# EasyEDA Pro project ProPrj_BrainStimulator-4Channels-Prototype_2025-12-16.epro, schematic Analog Channel
Board Name: Board2; Create Date: 2025-11-10; Page Name: P1; Project Name: BrainStimulator-4Channels-Prototype; Schematic Name: Schematic2; Update Date: 2025-11-10; Company: 嘉立创EDA; Page Size: A4; Version: V1.0
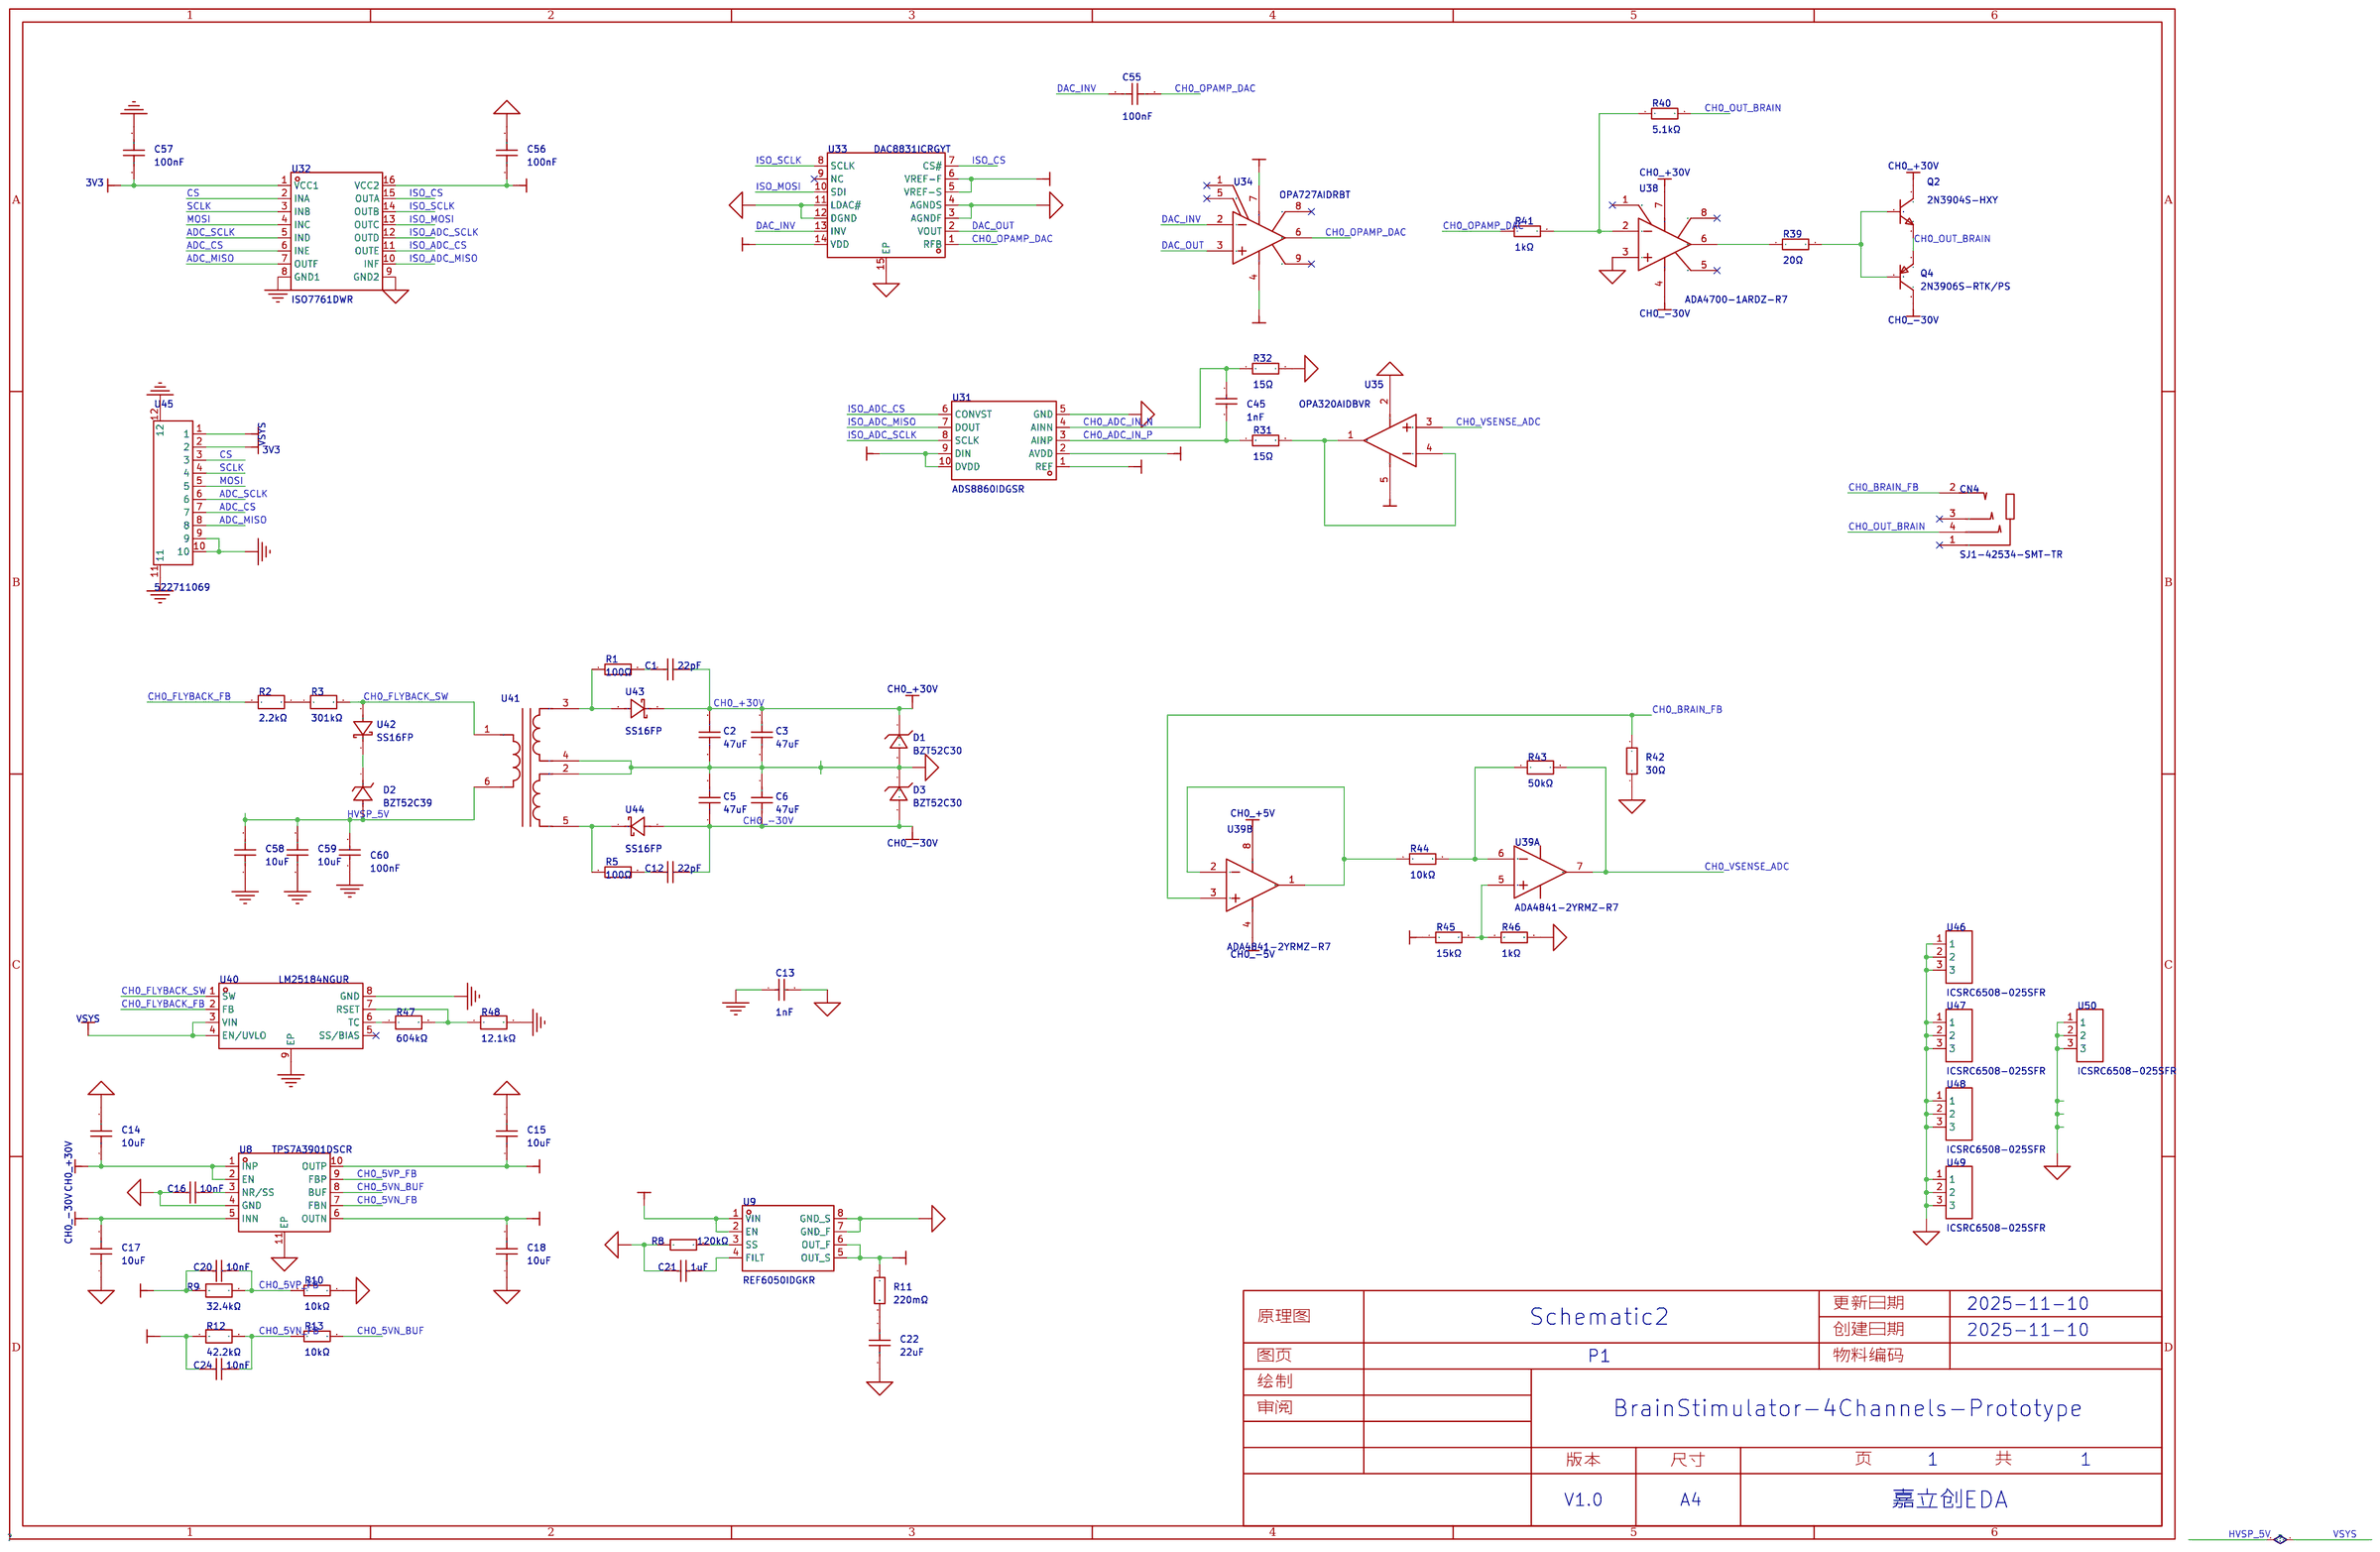
[diagram p1: schematic sheet]

## Parts
C1  22pF  [C0805]
C2  47uF  [CAP-SMD_L6.1-W5.3-L]
C3  47uF  [CAP-SMD_L6.1-W5.3-L]
C5  47uF  [CAP-SMD_L6.1-W5.3-L]
C6  47uF  [CAP-SMD_L6.1-W5.3-L]
C12  22pF  [C0805]
C13  1nF  [C1812]
C14  10uF  [C0805]
C15  10uF  [C0603]
C16  10nF  [C0603]
C17  10uF  [C0805]
C18  10uF  [C0603]
C20  10nF  [C0603]
C21  1uF  [C0603]
C22  22uF  [C0603]
C24  10nF  [C0603]
C45  1nF  [C0603]
C55  100nF  [C0603]
C56  100nF  [C0603]
C57  100nF  [C0603]
C58  10uF  [C0805]
C59  10uF  [C0805]
C60  100nF  [C0805]
CN4  SJ1-42534-SMT-TR  [AUDIO-SMD_SJ1-42534-SMT-TR]
D1  BZT52C30  [SOD-123_L2.8-W1.8-LS3.7-RD]
D2  BZT52C39  [SOD-123_L2.7-W1.6-LS3.7-RD-1]
D3  BZT52C30  [SOD-123_L2.8-W1.8-LS3.7-RD]
Q2  2N3904S-HXY  [SOT-23-3_L3.0-W1.7-P0.95-LS2.9-BR]
Q4  2N3906S-RTK/PS  [SOT-23-3_L2.9-W1.3-P1.90-LS2.4-TR]
R1  100Ω  [R0805]
R2  2.2kΩ  [R0603]
R3  301kΩ  [RES-SMD_L2.0-W1.3]
R5  100Ω  [R0805]
R8  120kΩ  [R0603]
R9  32.4kΩ  [R0603]
R10  10kΩ  [R0603]
R11  220mΩ  [R0603]
R12  42.2kΩ  [R0603]
R13  10kΩ  [R0603]
R31  15Ω  [R0603]
R32  15Ω  [R0603]
R39  20Ω  [R0603]
R40  5.1kΩ  [R0805]
R41  1kΩ  [R0603]
R42  30Ω  [R0805]
R43  50kΩ  [R0603]
R44  10kΩ  [R0603]
R45  15kΩ  [R0603]
R46  1kΩ  [R0603]
R47  604kΩ  [R0603]
R48  12.1kΩ  [R0603]
U8  TPS7A3901DSCR  [WSON-10_L3.0-W3.0-P0.50-BL-EP]
U9  REF6050IDGKR  [VSSOP-8_L3.0-W3.0-P0.65-LS4.9-BL]
U31  ADS8860IDGSR  [VSSOP-10_L3.0-W3.0-P0.50-LS4.9-BL]
U32  ISO7761DWR  [SOIC-16_L10.3-W7.5-P1.27-LS10.3-BL]
U33  DAC8831ICRGYT  [VQFN-14_L3.5-W3.5-P0.50-BL-EP]
U34  OPA727AIDRBT  [SON-8_L3.0-W3.0-P0.65-TL-EP]
U35  OPA320AIDBVR  [SOT-23-5_L3.0-W1.7-P0.95-LS2.8-BR]
U38  ADA4700-1ARDZ-R7  [SOIC-8_L4.9-W3.9-P1.27-LS6.0-BL-EP3.1]
U39  ADA4841-2YRMZ-R7  [MSOP-8_L3.0-W3.0-P0.65-LS4.9-BL]  (sections 1,2)
U40  LM25184NGUR  [WSON-8_L4.0-W4.0-P0.80-BL-EP]
U41  -  [LPH8045]
U42  SS16FP  [SOD-123_L2.8-W1.8-LS3.7-RD]
U43  SS16FP  [SOD-123_L2.8-W1.8-LS3.7-RD]
U44  SS16FP  [SOD-123_L2.8-W1.8-LS3.7-RD]
U45  522711069  [FPC-SMD_10P-P1.00_522711069]
U46  ICSRC6508-025SFR  [SMD-3P_L6.5-W0.8_ICSRC6508-030SFR]
U47  ICSRC6508-025SFR  [SMD-3P_L6.5-W0.8_ICSRC6508-030SFR]
U48  ICSRC6508-025SFR  [SMD-3P_L6.5-W0.8_ICSRC6508-030SFR]
U49  ICSRC6508-025SFR  [SMD-3P_L6.5-W0.8_ICSRC6508-030SFR]
U50  ICSRC6508-025SFR  [SMD-3P_L6.5-W0.8_ICSRC6508-030SFR]

## Library data of the parts
C1 C12 = CL21C220JBANNNC: 容值:22pF;精度:±5%;额定电压:50V;温度系数:C0G;; LCSC Part Name: 22pF ±5% 50V; Supplier Part: C1804; Manufacturer: SAMSUNG(三星); Supplier Footprint: 0805; JLCPCB Part Class: 基础库; Datasheet: https://item.szlcsc.com/datasheet/CL21C220JBANNNC/2156.html; Supplier: LCSC; Tolerance: ±5%; Voltage Rating: 50V; Temperature Coefficient: C0G
C2 C3 C5 C6 = KCM55WR71H476MH13L_C7213084: 容值:47uF;精度:±20%;额定电压:50V;材质(温度系数):X7R;; LCSC Part Name: 47uF ±20% 50V; Supplier Part: C7213084; Manufacturer: muRata(村田); Manufacturer Part: KCM55WR71H476MH13L; Supplier Footprint: SMD,6.1x5.3mm; JLCPCB Part Class: 扩展库; Datasheet: https://atta.szlcsc.com/upload/public/pdf/source/20221122/77B6F680BD34272D8B01742B842790FD.pdf; Supplier: LCSC; Tolerance: ±20%; Voltage Rated: 50V; Temperature Coefficient: X7R
C13 = 1812B102K202NT: 容值:1nF;精度:±10%;额定电压:2kV;温度系数:X7R;; LCSC Part Name: 1nF ±10% 2kV; Supplier Part: C36077; Manufacturer: FH(风华); Supplier Footprint: 1812; JLCPCB Part Class: 扩展库; Datasheet: https://atta.szlcsc.com/upload/public/pdf/source/20200305/C486355_26A10D38EF8C2A5C37091D0039909270.pdf; Supplier: LCSC; Tolerance: ±10%; Voltage Rating: 2kV; Temperature Coefficient: X7R
C14 C17 C58 C59 = GRM21BR61H106KE43L: 容值:10uF;精度:±10%;额定电压:50V;温度系数:X5R;; LCSC Part Name: 10uF ±10% 50V; Supplier Part: C440198; Manufacturer: muRata(村田); Supplier Footprint: 0805; JLCPCB Part Class: Basic Part; Datasheet: https://item.szlcsc.com/datasheet/GRM21BR61H106KE43L/439567.html; Supplier: LCSC; Tolerance: ±10%; Voltage Rating: 50V; Temperature Coefficient: X5R
C15 C18 = CL10A106MA8NRNC: 容值:10uF;精度:±20%;额定电压:25V;温度系数:X5R;; LCSC Part Name: 10uF ±20% 25V; Supplier Part: C96446; Manufacturer: SAMSUNG(三星); Supplier Footprint: 0603; JLCPCB Part Class: 基础库; Datasheet: https://item.szlcsc.com/datasheet/CL10A106MA8NRNC/97651.html; Supplier: LCSC; Tolerance: ±20%; Voltage Rating: 25V; Temperature Coefficient: X5R
C16 C20 C24 = 0603B103K500NT: 容值:10nF;精度:±10%;额定电压:50V;温度系数:X7R;; LCSC Part Name: 10nF ±10% 50V; Supplier Part: C57112; Manufacturer: FH(风华); Supplier Footprint: 0603; JLCPCB Part Class: Basic Part; Datasheet: https://item.szlcsc.com/datasheet/0603B103K500NT/58143.html; Supplier: LCSC; Tolerance: ±10%; Voltage Rating: 50V; Temperature Coefficient: X7R
C21 = CL10A105KA8NNNC: 容值:1uF;精度:±10%;额定电压:25V;温度系数:X5R;; LCSC Part Name: 1uF ±10% 25V; Supplier Part: C5673; Manufacturer: SAMSUNG(三星); Supplier Footprint: 0603; JLCPCB Part Class: Extended Part; Datasheet: https://item.szlcsc.com/datasheet/CL10A105KA8NNNC/6132.html; Supplier: LCSC; Tolerance: ±10%; Voltage Rating: 25V; Temperature Coefficient: X5R
C22 = CL10A226MO7JZNC: 容值:22uF;精度:±20%;额定电压:16V;温度系数:X5R;; LCSC Part Name: 22uF ±20% 16V; Supplier Part: C2762594; Manufacturer: SAMSUNG(三星); Supplier Footprint: 0603; JLCPCB Part Class: Extended Part; Datasheet: https://item.szlcsc.com/datasheet/CL10A226MO7JZNC/2889856.html; Supplier: LCSC; Tolerance: ±20%; Voltage Rating: 16V; Temperature Coefficient: X5R
C45 = CL10B102KB8NNNC: 容值:1nF;精度:±10%;额定电压:50V;温度系数:X7R;; LCSC Part Name: 1nF ±10% 50V; Supplier Part: C1588; Manufacturer: SAMSUNG(三星); Supplier Footprint: 0603; JLCPCB Part Class: Basic Part; Datasheet: https://item.szlcsc.com/datasheet/CL10B102KB8NNNC/1940.html; Supplier: LCSC; Tolerance: ±10%; Voltage Rating: 50V; Temperature Coefficient: X7R
C55-C57 = CC0603KRX7R9BB104: 容值:100nF;精度:±10%;额定电压:50V;温度系数:X7R;; LCSC Part Name: 100nF ±10% 50V; Supplier Part: C14663; Manufacturer: YAGEO(国巨); Supplier Footprint: 0603; JLCPCB Part Class: Basic Part; Datasheet: https://item.szlcsc.com/datasheet/CC0603KRX7R9BB104/15331.html; Supplier: LCSC; Tolerance: ±10%; Voltage Rating: 50V; Temperature Coefficient: X7R
C60 = CL21B104KCFNNNE: 容值:100nF;精度:±10%;额定电压:100V;温度系数:X7R;; LCSC Part Name: 100nF ±10% 100V; Supplier Part: C28233; Manufacturer: SAMSUNG(三星); Supplier Footprint: 0805; JLCPCB Part Class: Basic Part; Datasheet: https://item.szlcsc.com/datasheet/CL21B104KCFNNNE/28983.html; Supplier: LCSC; Tolerance: ±10%; Voltage Rating: 100V; Temperature Coefficient: X7R
CN4 = SJ1-42534-SMT-TR: 额定电流:300mA;额定电压:16V;触头材质:黄铜；铜合金;触头镀层:银;工作温度:-25℃~+85℃;; Supplier Part: C4992566; Manufacturer: CUI; Supplier Footprint: SMD; JLCPCB Part Class: Extended Part; Datasheet: https://item.szlcsc.com/datasheet/SJ1-42534-SMT-TR/5567438.html; Supplier: LCSC; Current Rating: 300mA; Voltage Rating (Max): 16V; Contact Material: 黄铜；铜合金; Contact Plating: 银; Operating Temperature: -25℃~+85℃
D1 D3 = BZT52C30_C266573: 二极管配置:独立式;稳压值(标称值):30V;稳压值(范围):28V~32V;耗散功率(Pd):500mW;; Supplier Part: C266573; Manufacturer: BORN(伯恩半导体); Supplier Footprint: SOD-123; JLCPCB Part Class: 扩展库; Datasheet: https://item.szlcsc.com/datasheet/BZT52C30/256922.html; Supplier: LCSC; Diode Configuration: 独立式; Zener Voltage(Nom): 30V; Reverse Leakage Current (Ir): 100nA; Zener Voltage(Range): 28V~32V; Pd - Power Dissipation: 500mW; Impedance(Zzt): 80Ω; Impedance(Zzk): 300Ω
D2 = BZT52C39_C511891: 二极管配置:独立式;稳压值(标称值):39V;稳压值(范围):37V~41V;耗散功率(Pd):500mW;; Supplier Part: C511891; Manufacturer: BORN(伯恩半导体); Supplier Footprint: SOD-123; JLCPCB Part Class: 扩展库; Datasheet: https://item.szlcsc.com/datasheet/BZT52C39/526356.html; Supplier: LCSC; Diode Configuration: 独立式; Zener Voltage(Nom): 39V; Reverse Leakage Current (Ir): 100nA; Zener Voltage(Range): 37V~41V; Pd - Power Dissipation: 500mW; Impedance(Zzt): 130Ω; Impedance(Zzk): 350Ω
Q2 = 2N3904S-HXY: 集电极电流(Ic):200mA;集射极击穿电压(Vceo):40V;耗散功率(Pd):200mW;直流电流增益(hFE):300@10mA,1V;; LCSC Part Name: 电流:200mA 电压:40V; Supplier Part: C46682376; Manufacturer: HXY MOSFET(华轩阳电子); Supplier Footprint: SOT-23; JLCPCB Part Class: 扩展库; Datasheet: https://item.szlcsc.com/datasheet/2N3904S-HXY/48843742.html; Supplier: LCSC; Current - Collector(Ic): 200mA; Collector - Emitter Voltage VCEO: 40V; Pd - Power Dissipation: 200mW; DC Current Gain: 300@10mA,1V; Transition frequency(fT): 300MHz; Current - Collector Cutoff: 100nA; Vce Saturation(VCE(sat)): 300mV@50mA,5mA; Emitter-Base Voltage(Vebo): 6V
Q4 = 2N3906S-RTK/PS: 集电极电流(Ic):200mA;集射极击穿电压(Vceo):40V;耗散功率(Pd):350mW;直流电流增益(hFE):300@10mA,1V;; Supplier Part: C5300004; Manufacturer: KEC; Supplier Footprint: SOT-23; JLCPCB Part Class: 扩展库; Datasheet: https://item.szlcsc.com/datasheet/2N3906S-RTK%252FPS/6051230.html; Supplier: LCSC; Current - Collector(Ic): 200mA; Collector - Emitter Voltage VCEO: 40V; Pd - Power Dissipation: 350mW; DC Current Gain: 300@10mA,1V; Transition frequency(fT): 250MHz; Current - Collector Cutoff: 50nA; Vce Saturation(VCE(sat)): 400mV@50mA,5mA; Emitter-Base Voltage(Vebo): 5V
R1 R5 = RK73H2ATTD1000F: 电阻类型:厚膜电阻;阻值:100Ω;精度:±1%;功率:250mW;工作电压:150V;温度系数:±100ppm/℃;; LCSC Part Name: 厚膜电阻 100Ω ±1% 250mW; Supplier Part: C317241; Manufacturer: KOA; Supplier Footprint: 0805; JLCPCB Part Class: 扩展库; Datasheet: https://item.szlcsc.com/datasheet/RK73H2ATTD1000F/298823.html; Supplier: LCSC; Type: 厚膜电阻; Tolerance: ±1%; Power(Watts): 250mW; Voltage-Supply(Max): 150V; Temperature Coefficient: ±100ppm/℃; Operating Temperature: -55℃~+155℃
R2 = RT0603BRD072K2L: 电阻类型:薄膜电阻;阻值:2.2kΩ;精度:±0.1%;功率:100mW;工作电压:75V;温度系数:±25ppm/℃;; LCSC Part Name: 薄膜电阻 2.2kΩ ±0.1% 100mW; Supplier Part: C861295; Manufacturer: YAGEO(国巨); Supplier Footprint: 0603; JLCPCB Part Class: 扩展库; Datasheet: https://item.szlcsc.com/datasheet/RT0603BRD072K2L/921633.html; Supplier: LCSC; Type: 薄膜电阻; Tolerance: ±0.1%; Power(Watts): 100mW; Voltage-Supply(Max): 75V; Temperature Coefficient: ±25ppm/℃; Operating Temperature: -55℃~+155℃
R3 = PTFR0805B301KP9: 电阻类型:薄膜电阻;阻值:301kΩ;精度:±0.1%;功率:130mW;工作电压:150V;温度系数:±25ppm/℃;; LCSC Part Name: 薄膜电阻 301kΩ ±0.1% 130mW; Supplier Part: C2849166; Manufacturer: RESI(开步睿思); Supplier Footprint: 0805; JLCPCB Part Class: 扩展库; Datasheet: https://item.szlcsc.com/datasheet/PTFR0805B301KP9/3048581.html; Supplier: LCSC; Type: 薄膜电阻; Tolerance: ±0.1%; Power(Watts): 130mW; Voltage-Supply(Max): 150V; Temperature Coefficient: ±25ppm/℃; Operating Temperature: -55℃~+155℃
R8 = 0603WAF1203T5E: 电阻类型:厚膜电阻;阻值:120kΩ;精度:±1%;功率:100mW;工作电压:75V;温度系数:±100ppm/℃;; LCSC Part Name: 120kΩ ±1% 100mW 厚膜电阻; Supplier Part: C25808; Manufacturer: UNI-ROYAL(厚声); Supplier Footprint: 0603; JLCPCB Part Class: Basic Part; Datasheet: https://item.szlcsc.com/datasheet/0603WAF1203T5E/26551.html; Supplier: LCSC; Type: 厚膜电阻; Tolerance: ±1%; Power(Watts): 100mW; Voltage-Supply(Max): 75V; Temperature Coefficient: ±100ppm/℃; Operating Temperature: -55℃~+155℃
R9 = FRC0603F3242TS: 电阻类型:厚膜电阻;阻值:32.4kΩ;精度:±1%;功率:100mW;工作电压:75V;温度系数:±100ppm/℃;; LCSC Part Name: 32.4kΩ ±1% 100mW 厚膜电阻; Supplier Part: C2998122; Manufacturer: FOJAN(富捷); Supplier Footprint: 0603; JLCPCB Part Class: Extended Part; Supplier: LCSC; Type: 厚膜电阻; Tolerance: ±1%; Power(Watts): 100mW; Voltage-Supply(Max): 75V; Temperature Coefficient: ±100ppm/℃; Operating Temperature: -55℃~+155℃
R10 R13 = 0603WAF1002T5E: 电阻类型:厚膜电阻;阻值:10kΩ;精度:±1%;功率:100mW;工作电压:75V;温度系数:±100ppm/℃;; LCSC Part Name: 厚膜电阻 10kΩ ±1% 100mW; Supplier Part: C25804; Manufacturer: UNI-ROYAL(厚声); Supplier Footprint: 0603; JLCPCB Part Class: Basic Part; Datasheet: https://item.szlcsc.com/datasheet/0603WAF1002T5E/26547.html; Supplier: LCSC; Type: 厚膜电阻; Tolerance: ±1%; Power(Watts): 100mW; Voltage-Supply(Max): 75V; Temperature Coefficient: ±100ppm/℃; Operating Temperature: -55℃~+155℃
R11 = 0603WAF220LT5E: 电阻类型:厚膜电阻;阻值:220mΩ;精度:±1%;功率:100mW;工作电压:75V;温度系数:±800ppm/℃;; LCSC Part Name: 220mΩ ±1% 100mW 厚膜电阻; Supplier Part: C20686; Manufacturer: UNI-ROYAL(厚声); Supplier Footprint: 0603; JLCPCB Part Class: Extended Part; Datasheet: https://item.szlcsc.com/datasheet/0603WAF220LT5E/21398.html; Supplier: LCSC; Type: 厚膜电阻; Tolerance: ±1%; Power(Watts): 100mW; Voltage-Supply(Max): 75V; Temperature Coefficient: ±800ppm/℃; Operating Temperature: -55℃~+155℃
R12 = FRC0603F4222TS: 电阻类型:厚膜电阻;阻值:42.2kΩ;精度:±1%;功率:100mW;工作电压:75V;温度系数:±100ppm/℃;; LCSC Part Name: 42.2kΩ ±1% 100mW 厚膜电阻; Supplier Part: C5126245; Manufacturer: FOJAN(富捷); Supplier Footprint: 0603; JLCPCB Part Class: Extended Part; Supplier: LCSC; Type: 厚膜电阻; Tolerance: ±1%; Power(Watts): 100mW; Voltage-Supply(Max): 75V; Temperature Coefficient: ±100ppm/℃; Operating Temperature: -55℃~+155℃
R31 R32 = RC0603FR-0715RL: 电阻类型:厚膜电阻;阻值:15Ω;精度:±1%;功率:100mW;工作电压:75V;温度系数:±100ppm/℃;; LCSC Part Name: 厚膜电阻 15Ω ±1% 100mW; Supplier Part: C128059; Manufacturer: YAGEO(国巨); Supplier Footprint: 0603; JLCPCB Part Class: Extended Part; Datasheet: https://item.szlcsc.com/datasheet/RC0603FR-0715RL/139344.html; Supplier: LCSC; Type: 厚膜电阻; Tolerance: ±1%; Power(Watts): 100mW; Voltage-Supply(Max): 75V; Temperature Coefficient: ±100ppm/℃; Operating Temperature: -55℃~+155℃
R39 = 0603WAF200JT5E: 电阻类型:厚膜电阻;阻值:20Ω;精度:±1%;功率:100mW;最大工作电压:75V;温度系数:±100ppm/℃;; LCSC Part Name: 20Ω ±1% 100mW 厚膜电阻; Supplier Part: C22950; Manufacturer: UNI-ROYAL(厚声); Supplier Footprint: 0603; JLCPCB Part Class: Basic Part; Datasheet: https://atta.szlcsc.com/upload/public/pdf/source/20200306/C422600_1E6D84923E4A46A82E41ADD87F860B5C.pdf; Supplier: LCSC; Type: 厚膜电阻; Tolerance: ±1%; Power(Watts): 100mW; Overload Voltage (Max): 75V; Temperature Coefficient: ±100ppm/℃; Operating Temperature Range: -55℃~+155℃
R40 = 0805W8F5101T5E: 电阻类型:厚膜电阻;阻值:5.1kΩ;精度:±1%;功率:125mW;工作电压:150V;温度系数:±100ppm/℃;; LCSC Part Name: 5.1kΩ ±1% 125mW 厚膜电阻; Supplier Part: C27834; Manufacturer: UNI-ROYAL(厚声); Supplier Footprint: 0805; JLCPCB Part Class: Basic Part; Datasheet: https://item.szlcsc.com/datasheet/0805W8F5101T5E/28584.html; Supplier: LCSC; Type: 厚膜电阻; Tolerance: ±1%; Power(Watts): 125mW; Voltage-Supply(Max): 150V; Temperature Coefficient: ±100ppm/℃; Operating Temperature: -55℃~+155℃
R41 = 0603WAF1001T5E: 电阻类型:厚膜电阻;阻值:1kΩ;精度:±1%;功率:100mW;最大工作电压:75V;温度系数:±100ppm/℃;; LCSC Part Name: 1kΩ ±1% 100mW 厚膜电阻; Supplier Part: C21190; Manufacturer: UNI-ROYAL(厚声); Supplier Footprint: 0603; JLCPCB Part Class: Basic Part; Datasheet: https://atta.szlcsc.com/upload/public/pdf/source/20200306/C422600_1E6D84923E4A46A82E41ADD87F860B5C.pdf; Supplier: LCSC; Type: 厚膜电阻; Tolerance: ±1%; Power(Watts): 100mW; Overload Voltage (Max): 75V; Temperature Coefficient: ±100ppm/℃; Operating Temperature Range: -55℃~+155℃
R42 = 0805W8F300JT5E: 电阻类型:厚膜电阻;阻值:30Ω;精度:±1%;功率:125mW;工作电压:150V;温度系数:±100ppm/℃;; LCSC Part Name: 30Ω ±1% 125mW 厚膜电阻; Supplier Part: C17622; Manufacturer: UNI-ROYAL(厚声); Supplier Footprint: 0805; JLCPCB Part Class: Extended Part; Datasheet: https://item.szlcsc.com/datasheet/0805W8F300JT5E/18310.html; Supplier: LCSC; Type: 厚膜电阻; Tolerance: ±1%; Power(Watts): 125mW; Voltage-Supply(Max): 150V; Temperature Coefficient: ±100ppm/℃; Operating Temperature: -55℃~+155℃
R43 = RT0603BRD0750KL: 电阻类型:薄膜电阻;阻值:50kΩ;精度:±0.1%;功率:100mW;工作电压:75V;温度系数:±25ppm/℃;; LCSC Part Name: 薄膜电阻 50kΩ ±0.1% 100mW; Supplier Part: C861451; Manufacturer: YAGEO(国巨); Supplier Footprint: 0603; JLCPCB Part Class: Extended Part; Datasheet: https://item.szlcsc.com/datasheet/RT0603BRD0750KL/921789.html; Supplier: LCSC; Type: 薄膜电阻; Tolerance: ±0.1%; Power(Watts): 100mW; Voltage-Supply(Max): 75V; Temperature Coefficient: ±25ppm/℃; Operating Temperature: -55℃~+155℃
R44 = RT0603BRD0710KL: 电阻类型:薄膜电阻;阻值:10kΩ;精度:±0.1%;功率:100mW;工作电压:75V;温度系数:±25ppm/℃;; LCSC Part Name: 薄膜电阻 10kΩ ±0.1% 100mW; Supplier Part: C95204; Manufacturer: YAGEO(国巨); Supplier Footprint: 0603; JLCPCB Part Class: Extended Part; Datasheet: https://atta.szlcsc.com/upload/public/pdf/source/20250609/0E6D5617EADA80FA3B707391883DF2D5.pdf; Supplier: LCSC; Type: 薄膜电阻; Tolerance: ±0.1%; Power(Watts): 100mW; Voltage-Supply(Max): 75V; Temperature Coefficient: ±25ppm/℃; Operating Temperature: -55℃~+155℃
R45 = RC0603FR-0715KL: 电阻类型:厚膜电阻;阻值:15kΩ;精度:±1%;功率:100mW;工作电压:75V;温度系数:±100ppm/℃;; LCSC Part Name: 厚膜电阻 15kΩ ±1% 100mW; Supplier Part: C114661; Manufacturer: YAGEO(国巨); Supplier Footprint: 0603; JLCPCB Part Class: Extended Part; Datasheet: https://item.szlcsc.com/datasheet/RC0603FR-0715KL/115905.html; Supplier: LCSC; Type: 厚膜电阻; Tolerance: ±1%; Power(Watts): 100mW; Voltage-Supply(Max): 75V; Temperature Coefficient: ±100ppm/℃; Operating Temperature: -55℃~+155℃
R46 = RC0603FR-071KL: 电阻类型:厚膜电阻;阻值:1kΩ;精度:±1%;功率:100mW;工作电压:75V;温度系数:±100ppm/℃;; LCSC Part Name: 厚膜电阻 1kΩ ±1% 100mW; Supplier Part: C22548; Manufacturer: YAGEO(国巨); Supplier Footprint: 0603; JLCPCB Part Class: Extended Part; Datasheet: https://atta.szlcsc.com/upload/public/pdf/source/20180316/70C0E2BDAE7FCC62C531A5A58D202EE1.pdf; Supplier: LCSC; Type: 厚膜电阻; Tolerance: ±1%; Power(Watts): 100mW; Voltage-Supply(Max): 75V; Temperature Coefficient: ±100ppm/℃; Operating Temperature: -55℃~+155℃
R47 = FRC0603F6043TS: 电阻类型:厚膜电阻;阻值:604kΩ;精度:±1%;功率:100mW;工作电压:75V;温度系数:±100ppm/℃;; LCSC Part Name: 604kΩ ±1% 100mW 厚膜电阻; Supplier Part: C2933246; Manufacturer: FOJAN(富捷); Supplier Footprint: 0603; JLCPCB Part Class: Extended Part; Supplier: LCSC; Type: 厚膜电阻; Tolerance: ±1%; Power(Watts): 100mW; Voltage-Supply(Max): 75V; Temperature Coefficient: ±100ppm/℃; Operating Temperature: -55℃~+155℃
R48 = FRC0603F1212TS: 电阻类型:厚膜电阻;阻值:12.1kΩ;精度:±1%;功率:100mW;工作电压:75V;温度系数:±100ppm/℃;; LCSC Part Name: 12.1kΩ ±1% 100mW 厚膜电阻; Supplier Part: C2930059; Manufacturer: FOJAN(富捷); Supplier Footprint: 0603; JLCPCB Part Class: Extended Part; Supplier: LCSC; Type: 厚膜电阻; Tolerance: ±1%; Power(Watts): 100mW; Voltage-Supply(Max): 75V; Temperature Coefficient: ±100ppm/℃; Operating Temperature: -55℃~+155℃
U8 = TPS7A3901DSCR: 输出类型:可调;工作电压:33V;输出电压:1.2V~30V；0V~30V;输出电流:150mA;电源纹波抑制比(PSRR):56dB@(100kHz);输出极性:正极和负极;; LCSC Part Name: 150mA、33V、低噪声、高 PSRR、双通道、正负电压范围、低压降稳压器; Supplier Part: C2685819; Manufacturer: TI(德州仪器); Supplier Footprint: WSON-10-EP(3x3); JLCPCB Part Class: Extended Part; Datasheet: https://www.ti.com/cn/lit/gpn/tps7a39; Supplier: LCSC; Output Type: 可调; Voltage - Supply: 33V; Output Voltage: 1.2V~30V；0V~30V; Output Current: 150mA; Power Supply Rejection Ratio (PSRR): 56dB@(100kHz); Features: 软启动；过流保护；带使能；过热保护; Operating Temperature: -40℃~+125℃@(Tj); Output Configuration: 正极和负极; Number of Outputs: 2
U9 = REF6050IDGKR: 输出类型:固定;工作电压:5.3V~5.5V;输出电压:5V;输出电流:3mA;精度:±0.05%;; LCSC Part Name: 集成ADC驱动器缓冲器的高精度电压基准; Supplier Part: C2862546; Manufacturer: TI(德州仪器); Supplier Footprint: VSSOP-8-0.65mm; JLCPCB Part Class: Extended Part; Datasheet: https://www.ti.com/cn/lit/gpn/ref6033; Supplier: LCSC; Output Type: 固定; Voltage - Supply: 5.3V~5.5V; Output Voltage: 5V; Output Current: 3mA; Tolerance: ±0.05%; Temperature Coefficient: 5ppm/℃; Reference Type: 串联; Quiescent Current: 830uA; Noise - 1/10Hz to 10Hz: 3uVp-p; Noise - 10Hz to 10kHz: 5uVrms; Operating Temperature: -40℃~+125℃
U31 = ADS8860IDGSR: 分辨率:16位;采样率:1MHz;工作电压:2.7V~3.6V;接口类型:SPI;; LCSC Part Name: 16位、1MSPS、串行接口、微功耗、微型、单端输入、SAR模数转换器; Supplier Part: C2866559; Manufacturer: TI(德州仪器); Supplier Footprint: VSSOP-10-0.5mm; JLCPCB Part Class: Extended Part; Datasheet: https://www.ti.com/cn/lit/gpn/ads8860; Supplier: LCSC; Resolution(Bits): 16位; Sampling Rate: 1MHz; number of channels: 1; Voltage - Supply: 2.7V~3.6V; Interface: SPI; differential input: 否; Integral non - linearity: 2LSB; Operating Temperature: -40℃~+85℃; Signal-to-Noise Ratio: 93dB; Clock/Oscillator: 内置; Voltage Reference: 外置; ADC architecture: SAR; Supply Current (Iq): 50nA
U32 = ISO7761DWR: ISO7761 EMC 性能优异的六通道、5/1、增强型数字隔离器; LCSC Part Name: 高速、增强型六通道数字隔离器; Supplier Part: C2871529; Manufacturer: TI(德州仪器); Supplier Footprint: SOIC-16-300mil; JLCPCB Part Class: Extended Part; Datasheet: https://www.ti.com/cn/lit/gpn/iso7763; Supplier: LCSC; Number of Forward Channels: 5; Number of Reverse Channels: 1; Data Rate(Max): 100Mbps; Default Output: 低电平; Isolation Voltage(Vrms): 5000; CMTI(kV/us): 100kV/us; Operating Temperature: -55℃~+125℃; Voltage - Supply(VCCA): 2.25V~5.5V; Voltage - Supply(VCCB): 2.25V~5.5V; Propagation Delay(tpd): 11ns
U33 = DAC8831ICRGYT: 分辨率:16位;接口类型:SPI;工作电压:2.7V~5.5V;稳定时间:1us;积分非线性:1LSB;; LCSC Part Name: DAC8831 16bit超低功耗电压输出数模转换器; Supplier Part: C2679512; Manufacturer: TI(德州仪器); Supplier Footprint: VQFN-14-EP(3.5x3.5); JLCPCB Part Class: 扩展库; Datasheet: https://www.ti.com/cn/lit/gpn/dac8831; Supplier: LCSC; Resolution(Bits): 16位; Number of Channels: 1; Interface: SPI; Voltage - Supply: 2.7V~5.5V; Settling Time: 1us; Output Type: 电压-非缓冲; Integral non - linearity: 1LSB; Operating Temperature: -40℃~+85℃; Power-On Reset: 内置; Voltage Reference: 外置; Data rate: 50MHz; Supply Current (Iq): 5uA
U34 = OPA727AIDRBT: 放大器数:单路;增益带宽积(GBP):20MHz;输入偏置电流(Ib):85pA;压摆率(SR):30V/us;轨到轨:-;; Supplier Part: C2060503; Manufacturer: TI(德州仪器); Supplier Footprint: SON-8-EP(3x3); JLCPCB Part Class: Extended Part; Datasheet: https://www.ti.com/cn/lit/gpn/opa728; Supplier: LCSC; Number of Channels: 单路; Gain Bandwidth Product: 20MHz; Ib - Input Bias Current: 85pA; Slew Rate: 30V/us; Output Current: 40mA; Operating Temperature: -40℃~+125℃
U35 = OPA320AIDBVR: 放大器数:单路;增益带宽积(GBP):20MHz;输入偏置电流(Ib):0.2pA;输入失调电压(Vos):150uV;压摆率(SR):10V/us;轨到轨:轨到轨输入,轨到轨输出;; LCSC Part Name: 具备关断功能的精密、20 MHz、0.9 pA、低噪声、轨到轨输入输出CMOS运算放大器; Supplier Part: C92494; Manufacturer: TI(德州仪器); Supplier Footprint: SOT-23-5; JLCPCB Part Class: Extended Part; Datasheet: https://www.ti.com/cn/lit/gpn/opa320; Supplier: LCSC; Number of Channels: 单路; Gain Bandwidth Product: 20MHz; Ib - Input Bias Current: 0.2pA; Vos - Input Offset Voltage: 150uV; Common Mode Rejection Ratio(CMRR): 114dB; Slew Rate: 10V/us; Output Current: 65mA; Rail to Rail: 轨到轨输入,轨到轨输出; Input Offset Voltage Drift(Vos TC): 1.5uV/℃; Quiescent Current(Iq): 1.45mA; Operating Temperature: -40℃~+125℃; Single Supply: 1.8V~5.5V; Dual Supply: 900mV~2.75V；-2.75V~-900mV; Maximum Power Supply Range (Vdd-Vss): 5.5V; Noise density(eN): 7nV/√Hz@10kHz; Input Offset Current(Ios): 0.9pA
U38 = ADA4700-1ARDZ-R7: 放大器数:单路;轨到轨:轨到轨输出;增益带宽积(GBP):3.5MHz;输入失调电压(Vos):2mV;压摆率(SR):20V/us;输入偏置电流(Ib):15nA;; LCSC Part Name: 高压精密运算放大器; Supplier Part: C654219; Manufacturer: ADI(亚德诺); Supplier Footprint: SOIC-8-EP; JLCPCB Part Class: Extended Part; Datasheet: https://atta.szlcsc.com/upload/public/pdf/source/20201118/C578925_C62A38ED7A5C813266BD0C66C350E50B.pdf; Supplier: LCSC; Number of Circuits: 单路; Maximum Power Supply Range (Vdd-Vss): 100V; Rail to Rail: 轨到轨输出; Gain Bandwidth Product(GBP): 3.5MHz; Voltage - Input Offset(Vos): 2mV; Input Offset Voltage Drift (Vos TC): 13uV/℃; Slew Rate(SR): 20V/us; Current - Input Bias(Ib): 15nA; Noise density(eN): 14.7nV/√Hz@1kHz; Common Mode Rejection Ratio (CMRR): 108dB; Output Current: 72mA; Operating Temperature: -40℃~+85℃
U39 = ADA4841-2YRMZ-R7: 放大器数:双路;轨到轨:轨到轨输出;增益带宽积(GBP):-;输入失调电压(Vos):300uV;压摆率(SR):13V/us;输入偏置电流(Ib):3uA;; LCSC Part Name: 低功耗、低噪声、低失真、轨到轨输出放大器; Supplier Part: C183017; Manufacturer: ADI(亚德诺); Supplier Footprint: MSOP-8; JLCPCB Part Class: Extended Part; Datasheet: https://atta.szlcsc.com/upload/public/pdf/source/20180323/B1315D3543E5FCA7EF50FA5B7DCDCDD8.pdf; Supplier: LCSC; Number of Circuits: 双路; Maximum Power Supply Range (Vdd-Vss): 12V; Rail to Rail: 轨到轨输出; Voltage - Input Offset(Vos): 300uV; Input Offset Voltage Drift (Vos TC): 1uV/℃; Slew Rate(SR): 13V/us; Current - Input Bias(Ib): 3uA; Noise density(eN): 2.1nV/√Hz@100kHz; Common Mode Rejection Ratio (CMRR): 115dB; Output Current: 60mA; Operating Temperature: -40℃~+125℃
U40 = LM25184NGUR: 功能类型:升降压型;输出类型:固定;工作电压:4.5V~42V;输出电压:12V;输出电流:1A;; LCSC Part Name: 42V输入反激式隔离电源管理芯片; Supplier Part: C1513006; Manufacturer: TI(德州仪器); Supplier Footprint: WSON-8-EP(4x4); JLCPCB Part Class: 扩展库; Datasheet: https://www.ti.com/cn/lit/gpn/lm25184; Supplier: LCSC; Function: 升降压型; Output Type: 固定; Input Voltage: 4.5V~42V; Output Voltage: 12V; Output Current: 1A; Switching Frequency: 350kHz; Operating Temperature: -40℃~+150℃@(TJ); Synchronous Rectification: 否; Number of Outputs: 1; Topology: 反激式; Switch tube (built-in/external): 内置
U41 = LPH8045
U42-U44 = SS16FP: 正向压降(Vf):700mV@1A;直流反向耐压(Vr):60V;整流电流:1A;; LCSC Part Name: 电压:60V 电流:1A; Supplier Part: C894427; Manufacturer: onsemi(安森美); Supplier Footprint: SOD-123HE; JLCPCB Part Class: 扩展库; Datasheet: https://item.szlcsc.com/datasheet/SS16FP/959856.html; Supplier: LCSC; Voltage - Forward(Vf@If): 700mV@1A; Voltage - DC Reverse(Vr): 60V; Current - Rectified: 1A; Reverse Leakage Current (Ir): 400uA@60V; Operating Junction Temperature Range: -55℃~+150℃; Non-Repetitive Peak Forward Surge Current: 30A
U45 = 522711069: 触点类型:下接;触点数量:10P;间距:1mm;工作温度:-40℃~+85℃;; LCSC Part Name: 下接 P数:10P 间距:1mm; Supplier Part: C588180; Manufacturer: MOLEX; Supplier Footprint: SMD,P=1mm; JLCPCB Part Class: Extended Part; Datasheet: https://www.molex.com/content/dam/molex/molex-dot-com/products/automated/en-us/salesdrawingpdf/522/52271/522711069_sd.pdf?inline\; Supplier: LCSC; Contact Type: 下接; Number of Contacts: 10P; Pitch: 1mm; Contact Material: 磷青铜; Contact Plating: 金; Operating Temperature: -40℃~+85℃; Rated Voltage (Max): 50V; Current Rating (Max): 500mA
U46-U50 = ICSRC6508-025SFR: LCSC Part Name: ICT，屏蔽罩支架 ，长6.5mm*高1.22mm，ICSRC6508-025SFR; Supplier Part: C5200152; Manufacturer: ICT; JLCPCB Part Class: Extended Part; Datasheet: https://atta.szlcsc.com/upload/public/pdf/source/20221019/AEE7DE65683E6B437411DD1364BBCB8E.pdf; Supplier: LCSC; size: 6.5mm*1.22mm; colour: 白色

## Nets
3V3: C57.1 U32.1(VCC1) U45.2
AGND: C2.1 C3.1 C5.2 C6.2 C13.2 C14.2 C15.2 C16.1 C17.1 C18.1 C21.1 C22.2 C56.2 D1.2(A) D3.1(C) R8.1 R10.2 R32.2 R42.1 R46.2 U8.4(GND) U8.11(EP) U9.7(GND_F) U9.8(GND_S) U31.5(GND) U32.9(GND2) U33.3(AGNDF) U33.4(AGNDS) U33.11(LDAC#) U33.12(DGND) U33.15(EP) U35.2(V-) U38.3(IN+) U41.2 U41.4 U46.1 U46.2 U46.3 U47.1 U47.2 U47.3 U48.1 U48.2 U48.3 U49.1 U49.2 U49.3 U50.1 U50.2 U50.3
GND: C13.1 C57.2 C58.1 C59.1 C60.1 R48.2 U32.8(GND1) U40.8(GND) U40.9(EP) U45.9 U45.10 U45.11 U45.12
ADC_CS: U32.6(INE) U45.7
ADC_MISO: U32.7(OUTF) U45.8
ADC_SCLK: U32.5(IND) U45.6
CH0_5VN_BUF: R13.2 U8.8(BUF)
CH0_5VN_FB: C24.2 R12.2 R13.1 U8.7(FBN)
CH0_5VP_FB: C20.2 R9.2 R10.1 U8.9(FBP)
CH0_+5V: C15.1 C20.1 C56.1 R9.1 R45.1 U8.10(OUTP) U9.1(VIN) U9.2(EN) U31.2(AVDD) U31.9(DIN) U31.10(DVDD) U32.16(VCC2) U33.5(VREF−S) U33.6(VREF−F) U33.14(VDD) U34.7(V+) U35.5(V+) U39.8(+VS)
CH0_+30V: C1.2 C2.2 C3.2 C14.1 D1.1(C) Q2.3(C) U8.1(INP) U8.2(EN) U38.7(V+) U43.1(C)
CH0_-5V: C18.2 C24.1 R12.1 U8.6(OUTN) U34.4(V-) U39.4(-VS)
CH0_-30V: C5.1 C6.1 C12.2 C17.2 D3.2(A) Q4.3(C) U8.5(INN) U38.4(V-) U44.2(A)
CH0_ADC_IN_N: C45.1 R32.1 U31.4(AINN)
CH0_ADC_IN_P: C45.2 R31.1 U31.3(AINP)
CH0_ADC_VREF: R11.1 U9.5(OUT_S) U9.6(OUT_F) U31.1(REF)
CH0_BRAIN_FB: CN4.2 R42.2 U39.3(+IN 1)
CH0_FLYBACK_FB: R2.1 U40.2(FB)
CH0_FLYBACK_SW: R3.2 U40.1(SW) U41.1 U42.2(A)
CH0_OPAMP_DAC: C55.2 R41.1 U33.1(RFB) U34.6(OUT)
CH0_OUT_BRAIN: CN4.4 Q2.2(E) Q4.1(E) R40.2
CH0_VSENSE_ADC: R43.2 U35.3(IN+) U39.7(OUT 2)
CS: U32.2(INA) U45.3
DAC_INV: C55.1 U33.13(INV) U34.2(IN-)
DAC_OUT: U33.2(VOUT) U34.3(IN+)
ISO_ADC_CS: U31.6(CONVST) U32.11(OUTE)
ISO_ADC_MISO: U31.7(DOUT) U32.10(INF)
ISO_ADC_SCLK: U31.8(SCLK) U32.12(OUTD)
ISO_CS: U32.15(OUTA) U33.7(CS#)
ISO_MOSI: U32.13(OUTC) U33.10(SDI)
ISO_SCLK: U32.14(OUTB) U33.8(SCLK)
MOSI: U32.4(INC) U45.5
SCLK: U32.3(INB) U45.4
VSYS: C58.2 C59.2 C60.2 D2.2(A) U40.3(VIN) U40.4(EN/UVLO) U41.6 U45.1
$1N3: R45.2 R46.1 U39.5(+IN 2)
$1N11: R40.1 R41.2 U38.2(IN-)
$1N15: Q2.1(B) Q4.2(B) R39.2
$1N16: R39.1 U38.6(OUT)
$1N24: C22.1 R11.2
$1N33: C21.2 U9.4(FILT)
$1N34: R8.2 U9.3(SS)
$1N35: R31.2 U35.1(OUT) U35.4(IN-)
$1N47: C16.2 U8.3(NR/SS)
$1N76: R2.2 R3.1
$1N77: R43.1 R44.2 U39.6(-IN 2)
$1N80: R47.2 R48.1 U40.7(RSET)
$1N81: R47.1 U40.6(TC)
$1N89: R44.1 U39.1(OUT 1) U39.2(-IN 1)
$1N92: D2.1(K) U42.1(C)
$1N95: C12.1 R5.2
$1N96: C1.1 R1.2
$1N98: R5.1 U41.5 U44.1(C)
$1N99: R1.1 U41.3 U43.2(A)

Not connected (* = marked no-connect by the designer): CN4 1* 3*; U33 9(NC)*; U34 1(NC)* 5(NC)* 8(NC)* 9(EP)*; U38 1(NC)* 5(NC)* 8(NC)*; U40 5(SS/BIAS)*
